# Altium schematic sheet UL-SWAP-DaQ-Schematic.SchDoc
size A; SheetNumber: 1; SheetTotal: 15
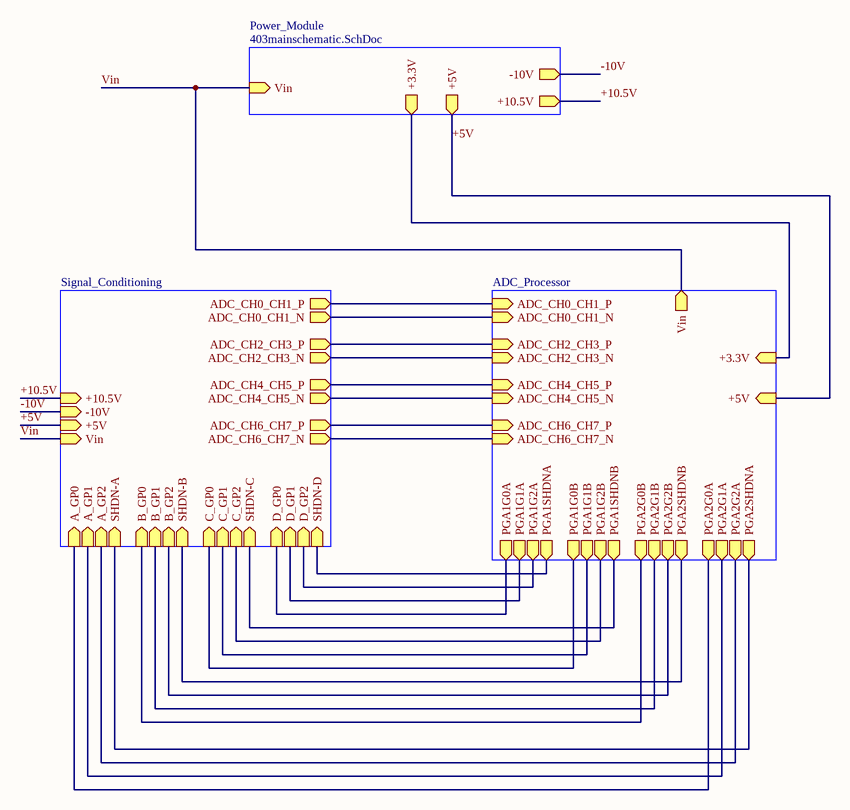
[diagram p0: UL-SWAP-DaQ-Schematic.SchDoc]

## Sub-sheets
ADC_Processor = ADC_PIC32_LVDS_DRIVER_Subsystem.SchDoc: PGA1G0A (out), PGA1G1A (out), PGA1G2A (out), PGA1SHDNA (out), PGA1G0B (out), PGA1G2B (out), PGA1SHDNB (out), PGA1G1B (out), PGA2G0B (out), PGA2G1B (out), PGA2G2B (out), PGA2SHDNB (out), PGA2G0A (out), PGA2G1A (out), PGA2G2A (out), PGA2SHDNA (out), ADC_CH6_CH7_N (in), ADC_CH6_CH7_P (in), ADC_CH4_CH5_N (in), ADC_CH4_CH5_P (in), ADC_CH2_CH3_N (in), ADC_CH2_CH3_P (in), ADC_CH0_CH1_P (in), ADC_CH0_CH1_N (in), +5V (in), +3.3V (in), Vin (out)
Power_Module = 403mainschematic.SchDoc: Vin (in), -10V (out), +3.3V (out), +10.5V (out), +5V (out)
Signal_Conditioning = Capstone_Signal_Conditioners_Subsystem_Test_Schematic.SchDoc: A_GP0 (in), A_GP1 (in), A_GP2 (in), SHDN-A (in), B_GP0 (in), B_GP1 (in), B_GP2 (in), SHDN-B (in), C_GP0 (in), C_GP1 (in), C_GP2 (in), SHDN-C (in), D_GP2 (in), D_GP1 (in), D_GP0 (in), SHDN-D (in), ADC_CH0_CH1_P (out), ADC_CH0_CH1_N (out), ADC_CH2_CH3_P (out), ADC_CH2_CH3_N (out), ADC_CH4_CH5_N (out), ADC_CH4_CH5_P (out), ADC_CH6_CH7_P (out), ADC_CH6_CH7_N (out), +10.5V (in), -10V (in), +5V (in), Vin (in)

## Nets
+5V: sheet Signal_Conditioning/+5V, sheet ADC_Processor/+5V, sheet Power_Module/+5V
+10.5V: sheet Signal_Conditioning/+10.5V, sheet Power_Module/+10.5V
-10V: sheet Signal_Conditioning/-10V, sheet Power_Module/-10V
Vin: sheet Signal_Conditioning/Vin, sheet ADC_Processor/Vin, sheet Power_Module/Vin
(unnamed): sheet Signal_Conditioning/A_GP0, sheet ADC_Processor/PGA2G0A
(unnamed): sheet Signal_Conditioning/A_GP1, sheet ADC_Processor/PGA2G1A
(unnamed): sheet Signal_Conditioning/A_GP2, sheet ADC_Processor/PGA2G2A
(unnamed): sheet Signal_Conditioning/SHDN-A, sheet ADC_Processor/PGA2SHDNA
(unnamed): sheet Signal_Conditioning/B_GP0, sheet ADC_Processor/PGA2G0B
(unnamed): sheet Signal_Conditioning/B_GP1, sheet ADC_Processor/PGA2G1B
(unnamed): sheet Signal_Conditioning/B_GP2, sheet ADC_Processor/PGA2G2B
(unnamed): sheet Signal_Conditioning/SHDN-B, sheet ADC_Processor/PGA2SHDNB
(unnamed): sheet Signal_Conditioning/C_GP0, sheet ADC_Processor/PGA1G0B
(unnamed): sheet Signal_Conditioning/C_GP1, sheet ADC_Processor/PGA1G1B
(unnamed): sheet Signal_Conditioning/C_GP2, sheet ADC_Processor/PGA1G2B
(unnamed): sheet Signal_Conditioning/SHDN-C, sheet ADC_Processor/PGA1SHDNB
(unnamed): sheet Signal_Conditioning/D_GP2, sheet ADC_Processor/PGA1G2A
(unnamed): sheet Signal_Conditioning/D_GP1, sheet ADC_Processor/PGA1G1A
(unnamed): sheet Signal_Conditioning/D_GP0, sheet ADC_Processor/PGA1G0A
(unnamed): sheet Signal_Conditioning/SHDN-D, sheet ADC_Processor/PGA1SHDNA
(unnamed): sheet Signal_Conditioning/ADC_CH0_CH1_P, sheet ADC_Processor/ADC_CH0_CH1_P
(unnamed): sheet Signal_Conditioning/ADC_CH0_CH1_N, sheet ADC_Processor/ADC_CH0_CH1_N
(unnamed): sheet Signal_Conditioning/ADC_CH2_CH3_P, sheet ADC_Processor/ADC_CH2_CH3_P
(unnamed): sheet Signal_Conditioning/ADC_CH2_CH3_N, sheet ADC_Processor/ADC_CH2_CH3_N
(unnamed): sheet Signal_Conditioning/ADC_CH4_CH5_N, sheet ADC_Processor/ADC_CH4_CH5_N
(unnamed): sheet Signal_Conditioning/ADC_CH4_CH5_P, sheet ADC_Processor/ADC_CH4_CH5_P
(unnamed): sheet Signal_Conditioning/ADC_CH6_CH7_P, sheet ADC_Processor/ADC_CH6_CH7_P
(unnamed): sheet Signal_Conditioning/ADC_CH6_CH7_N, sheet ADC_Processor/ADC_CH6_CH7_N
(unnamed): sheet ADC_Processor/+3.3V, sheet Power_Module/+3.3V